# Altium schematic sheet Sheet1.SchDoc
size A4
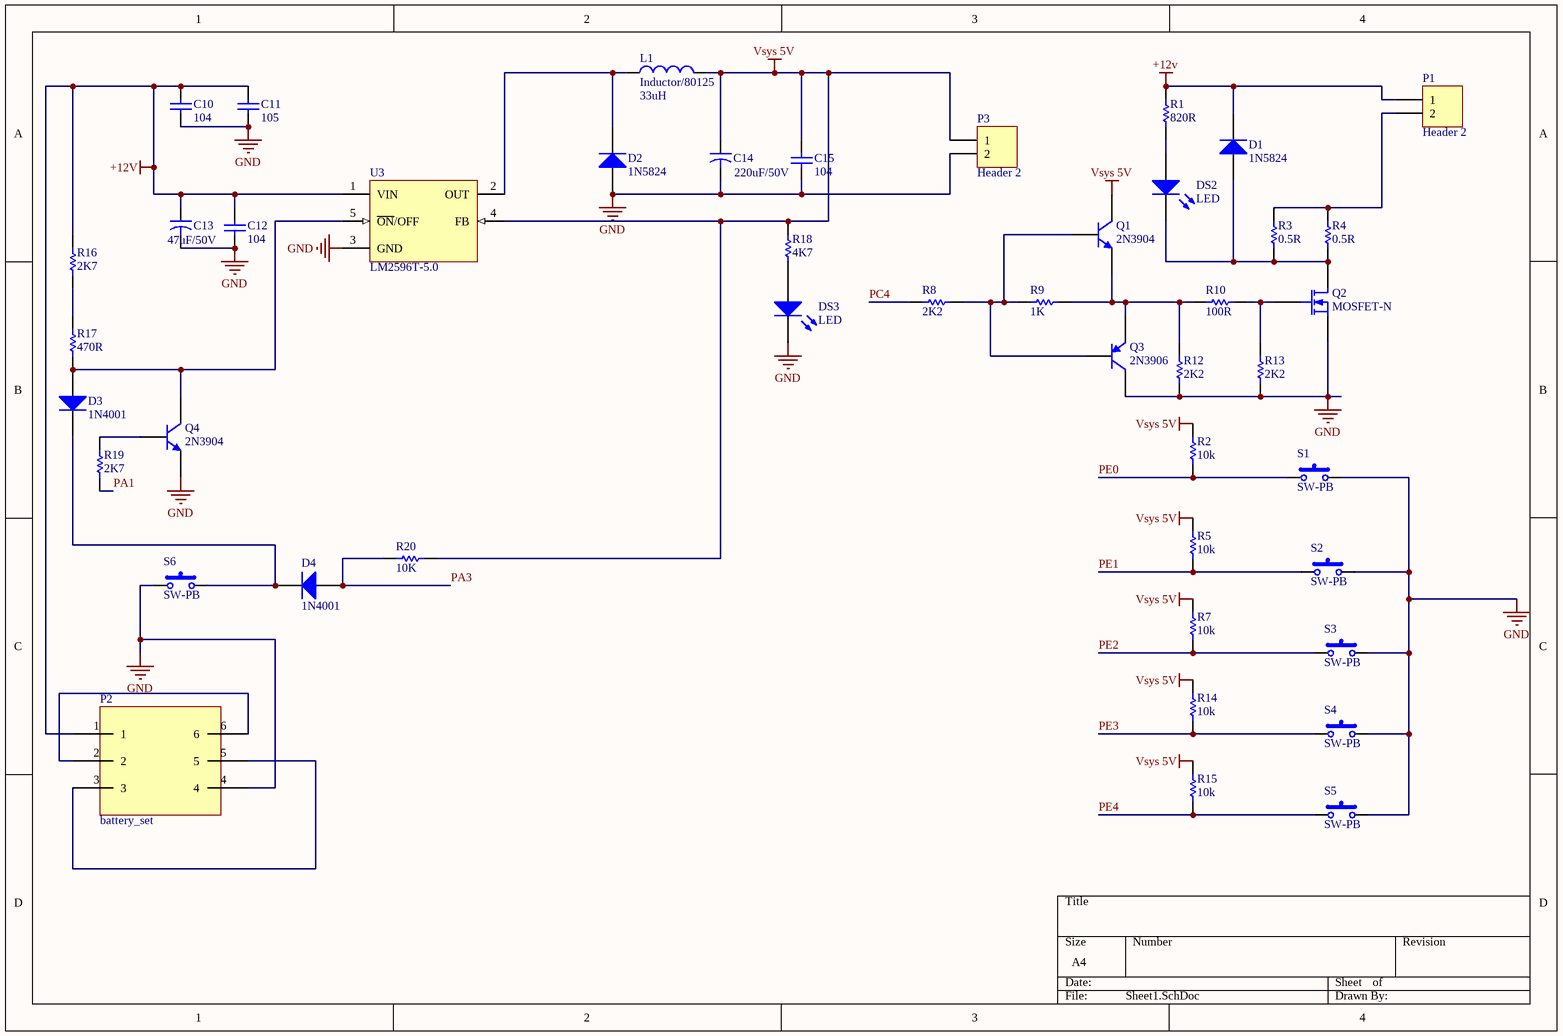
[diagram p0: Sheet1.SchDoc]

## Parts
C10  104  [C200]
C11  105  [C200]
C12  104  [C200]
C13  value 47uF/50V  [CAPR5-4X5]  (hidden comment: Cap2)
C14  value 220uF/50V  [CAPR5-4X5]  (hidden comment: Cap2)
C15  104  [C200]
D1  1N5824  [DO-201AD]
D2  1N5824  [DO-201AD]
D3  1N4001  [DO-41]
D4  1N4001  [DO-41]
DS2  LED  [LED-0]
DS3  LED  [LED-0]
L1  Inductor/80125  value 33uH  [T080125]
P1  Header 2  [HDR1X2]
P2  battery_set  [BATTERY_SET]
P3  Header 2  [HDR1X2]
Q1  2N3904  [TO-92A]
Q2  MOSFET-N  [E3]
Q3  2N3906  [TO-92A]
Q4  2N3904  [TO-92A]
R1  820R  [AXIAL-0.3]
R2  10k  [AXIAL-0.3]
R3  0.5R  [AXIAL-0.3]
R4  0.5R  [AXIAL-0.3]
R5  10k  [AXIAL-0.3]
R7  10k  [AXIAL-0.3]
R8  2K2  [AXIAL-0.3]
R9  1K  [AXIAL-0.3]
R10  100R  [AXIAL-0.3]
R12  2K2  [AXIAL-0.3]
R13  2K2  [AXIAL-0.3]
R14  10k  [AXIAL-0.3]
R15  10k  [AXIAL-0.3]
R16  2K7  [AXIAL-0.3]
R17  470R  [AXIAL-0.3]
R18  4K7  [AXIAL-0.3]
R19  2K7  [AXIAL-0.3]
R20  10K  [AXIAL-0.3]
S1  SW-PB  [TACK6]
S2  SW-PB  [TACK6]
S3  SW-PB  [TACK6]
S4  SW-PB  [TACK6]
S5  SW-PB  [TACK6]
S6  SW-PB  [TACK6]
U3  LM2596T-5.0  [T05D]

## Nets
+12v: C10.2 C11.2 C12.2 C13.1 D1.2(K) P1.1 P2.1 R1.2 R16.2 U3.1(VIN)
GND: C10.1 C11.1 C12.1 C13.2 C14.2 C15.1 D2.1(A) DS3.2(K) P2.4 P3.2 Q2.3(S) Q3.3(C) Q4.1(E) R12.2 R13.2 S1.2 S2.2 S3.2 S4.2 S5.2 S6.1 U3.3(GND)
Vsys 5V: C14.1 C15.2 L1.2 P3.1 Q1.3(C) R2.2 R5.1 R7.1 R14.1 R15.1 R18.2 R20.1 U3.4(FB)
PA1: R19.1
PA3: D4.1(A) R20.2
PC4: R8.2
PE0: R2.1 S1.1
PE1: R5.2 S2.1
PE2: R7.2 S3.1
PE3: R14.2 S4.1
PE4: R15.2 S5.1
NetD1_1: D1.1(A) DS2.2(K) Q2.1(D) R3.1 R4.1
NetD2_2: D2.2(K) L1.1 U3.2(OUT)
NetD3_1: D3.1(A) Q4.3(C) R17.1 U3.5(~{ON}/OFF)
NetD3_2: D3.2(K) D4.2(K) S6.2
NetDS2_1: DS2.1(A) R1.1
NetDS3_1: DS3.1(A) R18.1
NetP1_2: P1.2 R3.2 R4.2
NetP2_2: P2.2 P2.6
NetP2_3: P2.3 P2.5
NetQ1_1: Q1.1(E) Q3.1(E) R9.1 R10.2 R12.1
NetQ1_2: Q1.2(B) Q3.2(B) R8.1 R9.2
NetQ2_2: Q2.2(G) R10.1 R13.1
NetQ4_2: Q4.2(B) R19.2
NetR16_1: R16.1 R17.2

## Library data of the parts
C10-C12 C15 = Cap: Capacitor; Published: 8-Jun-2000; LatestRevisionDate: 17-Jul-2002; LatestRevisionNote: Re-released for DXP Platform.; PackageReference: RAD-0.3; Publisher: Altium Limited
C13 C14 = Cap2: Capacitor; Published: 23-Sep-2002; PackageReference: CAPR5-4X5; Publisher: Altium Limited; PackageDescription: Capacitor; 2 Leads
D1 D2 = Diode 1N5408: 3 Amp Medium Power Silicon Rectifier Diode; Published: 8-Jun-2000; LatestRevisionDate: 17-Jul-2002; LatestRevisionNote: Re-released for DXP Platform.; DatasheetVersion: Aug-1984; PackageReference: DO-201AD; Publisher: Altium Limited; PackageDescription: Diode, Axial; Body 9.5 x 5.3 mm (LxDia. max), Lead Dia. 1.32 mm (max); ComponentLink1Description: Manufacturer Link; ComponentLink1URL: http://www.irf.com/
D3 D4 = Diode 1N4001: 1 Amp General Purpose Rectifier; Published: 8-Jun-2000; LatestRevisionDate: 17-Jul-2002; LatestRevisionNote: Re-released for DXP Platform.; DatasheetVersion: 1998; PackageVersion: Aug-1999; PackageReference: DO-41; Publisher: Altium Limited; PackageDescription: Diode, Axial; Body 5.2 x 2.7 mm (LxDia. max), Lead Dia. 0.86 mm (max); Code_JEDEC: DO-204-AL; ComponentLink1Description: Manufacturer Link; ComponentLink1URL: http://www.fairchildsemi.com/; ComponentLink2Description: Datasheet; ComponentLink2URL: http://www.fairchildsemi.com/ds/1N%2F1N4001.pdf
DS2 DS3 = LED0: Typical INFRARED GaAs LED; Published: 8-Jun-2000; LatestRevisionDate: 08-Jul-2005; LatestRevisionNote: Mech Layer 1 removed.; PackageReference: LED-0; Publisher: Altium Limited; PackageDescription: LED; 2 Leads
L1 = Inductor: Code_IEC: 1005; Published: 8-Jun-2000; LatestRevisionDate: 29-May-2009; LatestRevisionNote: IPC-7351 Footprint Added.; PackageReference: 0402-A; Publisher: Altium Limited; PackageDescription: Chip Inductor; Code_JEITA: 0402
P1 P3 = Header 2: Header, 2-Pin; LatestRevisionDate: 17-Jul-2002; LatestRevisionNote: Re-released for DXP Platform.; Publisher: Altium Limited
Q1 Q4 = 2N3904: NPN General Purpose Amplifier; Published: 8-Jun-2000; LatestRevisionDate: 15-Jan-2003; LatestRevisionNote: PCB Footprint 'BCY-W3/D4.7' replaced; DatasheetVersion: 1997; PackageVersion: Sep-1998; PackageReference: TO-92A; Publisher: Altium Limited; PackageDescription: TO, Flat Index; 3 In-Line, Axial Leads; Body Dia. 4.5mm; Leads 0.51 x 0.48 mm (max); ComponentLink1Description: Manufacturer Link; ComponentLink1URL: http://www.fairchildsemi.com/; ComponentLink2Description: Datasheet; ComponentLink2URL: http://www.fairchildsemi.com/ds/2N%2F2N3904.pdf
Q2 = MOSFET-N: N-Channel MOSFET; Published: 8-Jun-2000; LatestRevisionDate: 17-Jul-2002; LatestRevisionNote: Re-released for DXP Platform.; PackageVersion: 1995/1996; PackageReference: E3; Publisher: Altium Limited; PackageDescription: TO, Flat Index; 3 In-Line, Axial Leads; Body Dia. 4.6mm; Lead Dia. 0.5 mm (max)
Q3 = 2N3906: PNP General Purpose Amplifier; Published: 8-Jun-2000; LatestRevisionDate: 15-Jan-2003; LatestRevisionNote: PCB Footprint 'BCY-W3/D4.7' replaced; DatasheetVersion: 1997; PackageVersion: Sep-1998; PackageReference: TO-92A; Publisher: Altium Limited; PackageDescription: TO, Flat Index; 3 In-Line, Axial Leads; Body Dia. 4.5mm; Leads 0.51 x 0.48 mm (max); ComponentLink1Description: Manufacturer Link; ComponentLink1URL: http://www.fairchildsemi.com/; ComponentLink2Description: Datasheet; ComponentLink2URL: http://www.fairchildsemi.com/ds/2N%2F2N3906.pdf
R1-R5 R7-R10 R12-R20 = Res: Resistor; Published: 8-Jun-2000; LatestRevisionDate: 17-Jul-2002; LatestRevisionNote: Re-released for DXP Platform.; PackageReference: AXIAL-0.3; Publisher: Altium Limited
S1-S6 = SW-PB: Switch; Published: 24-Mar-1999; LatestRevisionDate: 17-Jul-2002; LatestRevisionNote: Re-released for DXP Platform.; PackageReference: SPST-2; Publisher: Altium Limited
U3 = LM2596T-5.0: SIMPLE SWITCHER?Power Converter 150 KHz 3A Step-Down Voltage Regulator, 5-pin TO-220; Manufacturer: National Semiconductor; PackageTopMarking: NSUZXYTTE#*LM2596T*-5.0 P+; PowerWise: N; Published: 4-Dec-2008; DatasheetVersion: May-2002; PackageVersion: revA, Oct-1989; PackageReference: T05D; Publisher: Altium Limited; PackageDescription: TO-220, Molded, Stagger Bend, 5 Lead; Supplier 1: Farnell; Supplier Part Number 1: 1206529; PartNumber: LM2596T-5.0; RoHS: N; PinCount: 5; CompType: Switcher; ComponentLink1Description: LM2596 Datasheet; ComponentLink1URL: http://www.national.com/ds/LM/LM2596.pdf; ComponentLink2Description: LM2596 Web Page; ComponentLink2URL: http://www.national.com/pf/LM/LM2596.html; ComponentLink3Description: T05D Package Page; ComponentLink3URL: http://www.national.com/packaging/folders/t05d.html